# Altium schematic sheet TOP.SchDoc
size A4; SheetNumber: 1; SheetTotal: 13
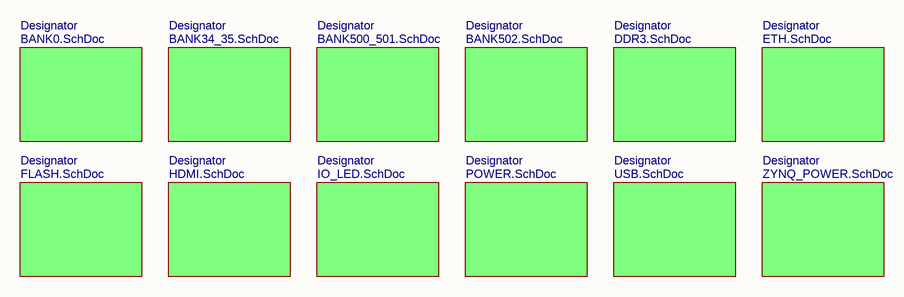
[diagram p0: TOP.SchDoc]

## Sub-sheets
Designator = BANK0.SchDoc: no entries
Designator = BANK34_35.SchDoc: no entries
Designator = BANK500_501.SchDoc: no entries
Designator = BANK502.SchDoc: no entries
Designator = DDR3.SchDoc: no entries
Designator = ETH.SchDoc: no entries
Designator = FLASH.SchDoc: no entries
Designator = HDMI.SchDoc: no entries
Designator = IO_LED.SchDoc: no entries
Designator = POWER.SchDoc: no entries
Designator = USB.SchDoc: no entries
Designator = ZYNQ_POWER.SchDoc: no entries